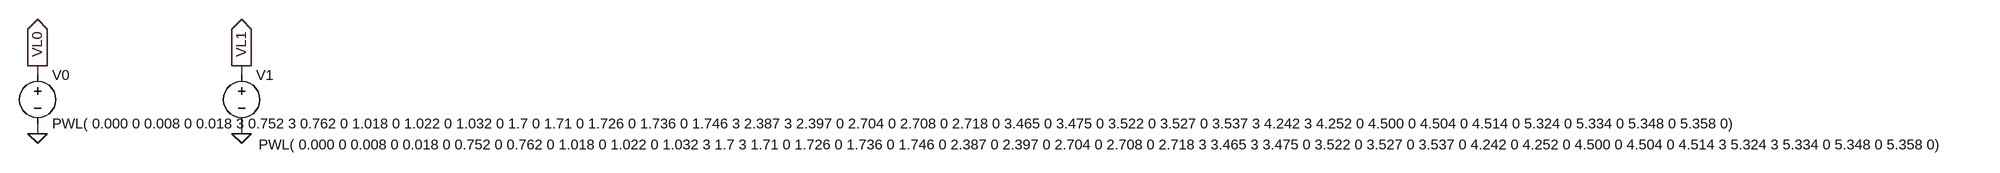
[diagram p0: schematic OutputLabels.asc]
OutputLabels.asc, the LTspice schematic file:
Version 4
SHEET 1 5664 680
WIRE 64 64 64 48
WIRE 400 64 400 48
WIRE 64 160 64 144
WIRE 400 160 400 144
FLAG 64 48 VL0
IOPIN 64 48 Out
FLAG 64 160 0
FLAG 400 48 VL1
IOPIN 400 48 Out
FLAG 400 160 0
SYMBOL voltage 64 48 R0
WINDOW 123 0 0 Left 2
WINDOW 39 0 0 Left 2
SYMATTR InstName V0
SYMATTR Value PWL( 0.000 0 0.008 0 0.018 3 0.752 3 0.762 0 1.018 0 1.022 0 1.032 0 1.7 0 1.71 0 1.726 0 1.736 0 1.746 3 2.387 3 2.397 0 2.704 0 2.708 0 2.718 0 3.465 0 3.475 0 3.522 0 3.527 0 3.537 3 4.242 3 4.252 0 4.500 0 4.504 0 4.514 0 5.324 0 5.334 0 5.348 0 5.358 0)
SYMBOL voltage 400 48 R0
WINDOW 123 0 0 Left 2
WINDOW 39 0 0 Left 2
WINDOW 3 28 130 Left 2
SYMATTR Value PWL( 0.000 0 0.008 0 0.018 0 0.752 0 0.762 0 1.018 0 1.022 0 1.032 3 1.7 3 1.71 0 1.726 0 1.736 0 1.746 0 2.387 0 2.397 0 2.704 0 2.708 0 2.718 3 3.465 3 3.475 0 3.522 0 3.527 0 3.537 0 4.242 0 4.252 0 4.500 0 4.504 0 4.514 3 5.324 3 5.334 0 5.348 0 5.358 0)
SYMATTR InstName V1

The netlist it stands for:
* OutputLabels.asc
V0 VL0 0 PWL( 0.000 0 0.008 0 0.018 3 0.752 3 0.762 0 1.018 0 1.022 0 1.032 0 1.7 0 1.71 0 1.726 0 1.736 0 1.746 3 2.387 3 2.397 0 2.704 0 2.708 0 2.718 0 3.465 0 3.475 0 3.522 0 3.527 0 3.537 3 4.242 3 4.252 0 4.500 0 4.504 0 4.514 0 5.324 0 5.334 0 5.348 0 5.358 0)
V1 VL1 0 PWL( 0.000 0 0.008 0 0.018 0 0.752 0 0.762 0 1.018 0 1.022 0 1.032 3 1.7 3 1.71 0 1.726 0 1.736 0 1.746 0 2.387 0 2.397 0 2.704 0 2.708 0 2.718 3 3.465 3 3.475 0 3.522 0 3.527 0 3.537 0 4.242 0 4.252 0 4.500 0 4.504 0 4.514 3 5.324 3 5.334 0 5.348 0 5.358 0)
.backanno
.end